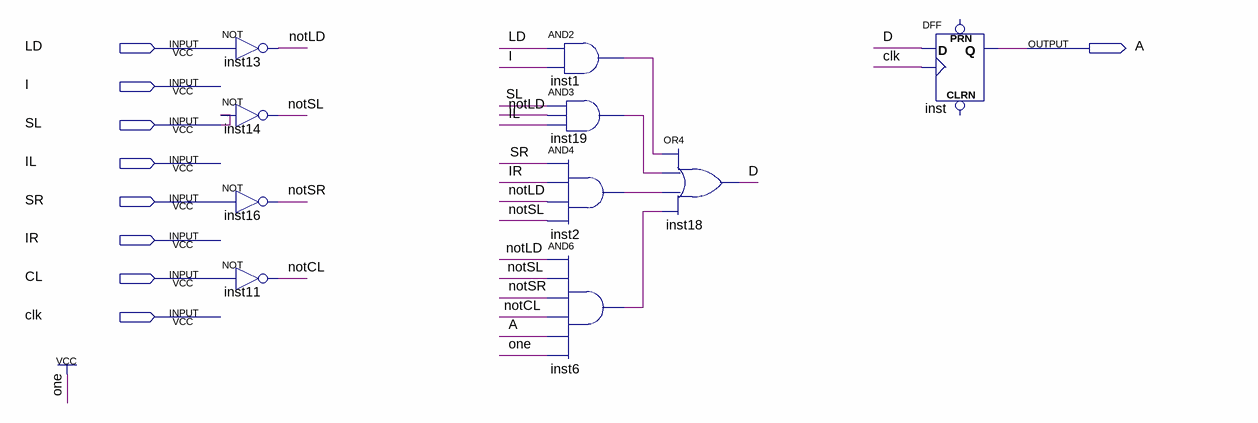
[diagram p0: schematic sheet]
// Quartus schematic REG1_LD_SL_SR_CL.bdf as structural Verilog: 10 symbols, 9 pins
module REG1_LD_SL_SR_CL (
  input  LD,
  input  I,
  input  SL,
  input  IL,
  input  SR,
  input  IR,
  input  CL,
  input  clk,
  output A
);

  wire D, inst1_out, inst2_out, inst6_out, inst19_out, notCL, notLD, notSL, notSR;

  not inst13 (notLD, LD);
  not inst14 (notSL, SL);
  not inst16 (notSR, SR);
  not inst11 (notCL, CL);
  and inst1 (inst1_out, LD, I);
  and inst19 (inst19_out, SL, notLD, IL);
  and inst2 (inst2_out, SR, IR, notLD, notSL);
  and inst6 (inst6_out, notLD, notSL, notSR, notCL, A, 1'b1);
  or inst18 (D, inst1_out, inst19_out, inst2_out, inst6_out);
  DFF inst (.CLK(clk), .D(D), .Q(A));  // open: CLRN, PRN
endmodule
